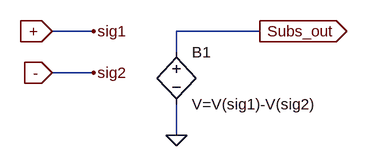
[diagram p0: schematic sub_lv1.asc]
sub_lv1.asc, the LTspice schematic file:
Version 4.1
SHEET 1 880 680
WIRE 32 80 -32 80
WIRE 288 80 160 80
WIRE 160 112 160 80
WIRE 32 144 -32 144
WIRE 160 240 160 192
FLAG 160 240 0
FLAG 32 80 sig1
FLAG 32 144 sig2
FLAG 288 80 Subs_out
IOPIN 288 80 Out
FLAG -32 80 +
IOPIN -32 80 In
FLAG -32 144 -
IOPIN -32 144 In
SYMBOL bv 160 96 R0
SYMATTR InstName B1
SYMATTR Value V=V(sig1)-V(sig2)

The netlist it stands for:
* sub_lv1.asc
B1 Subs_out 0 V=V(sig1)-V(sig2)
.backanno
.end